# EAGLE design IoTSchem (EAGLE 9.6.2)
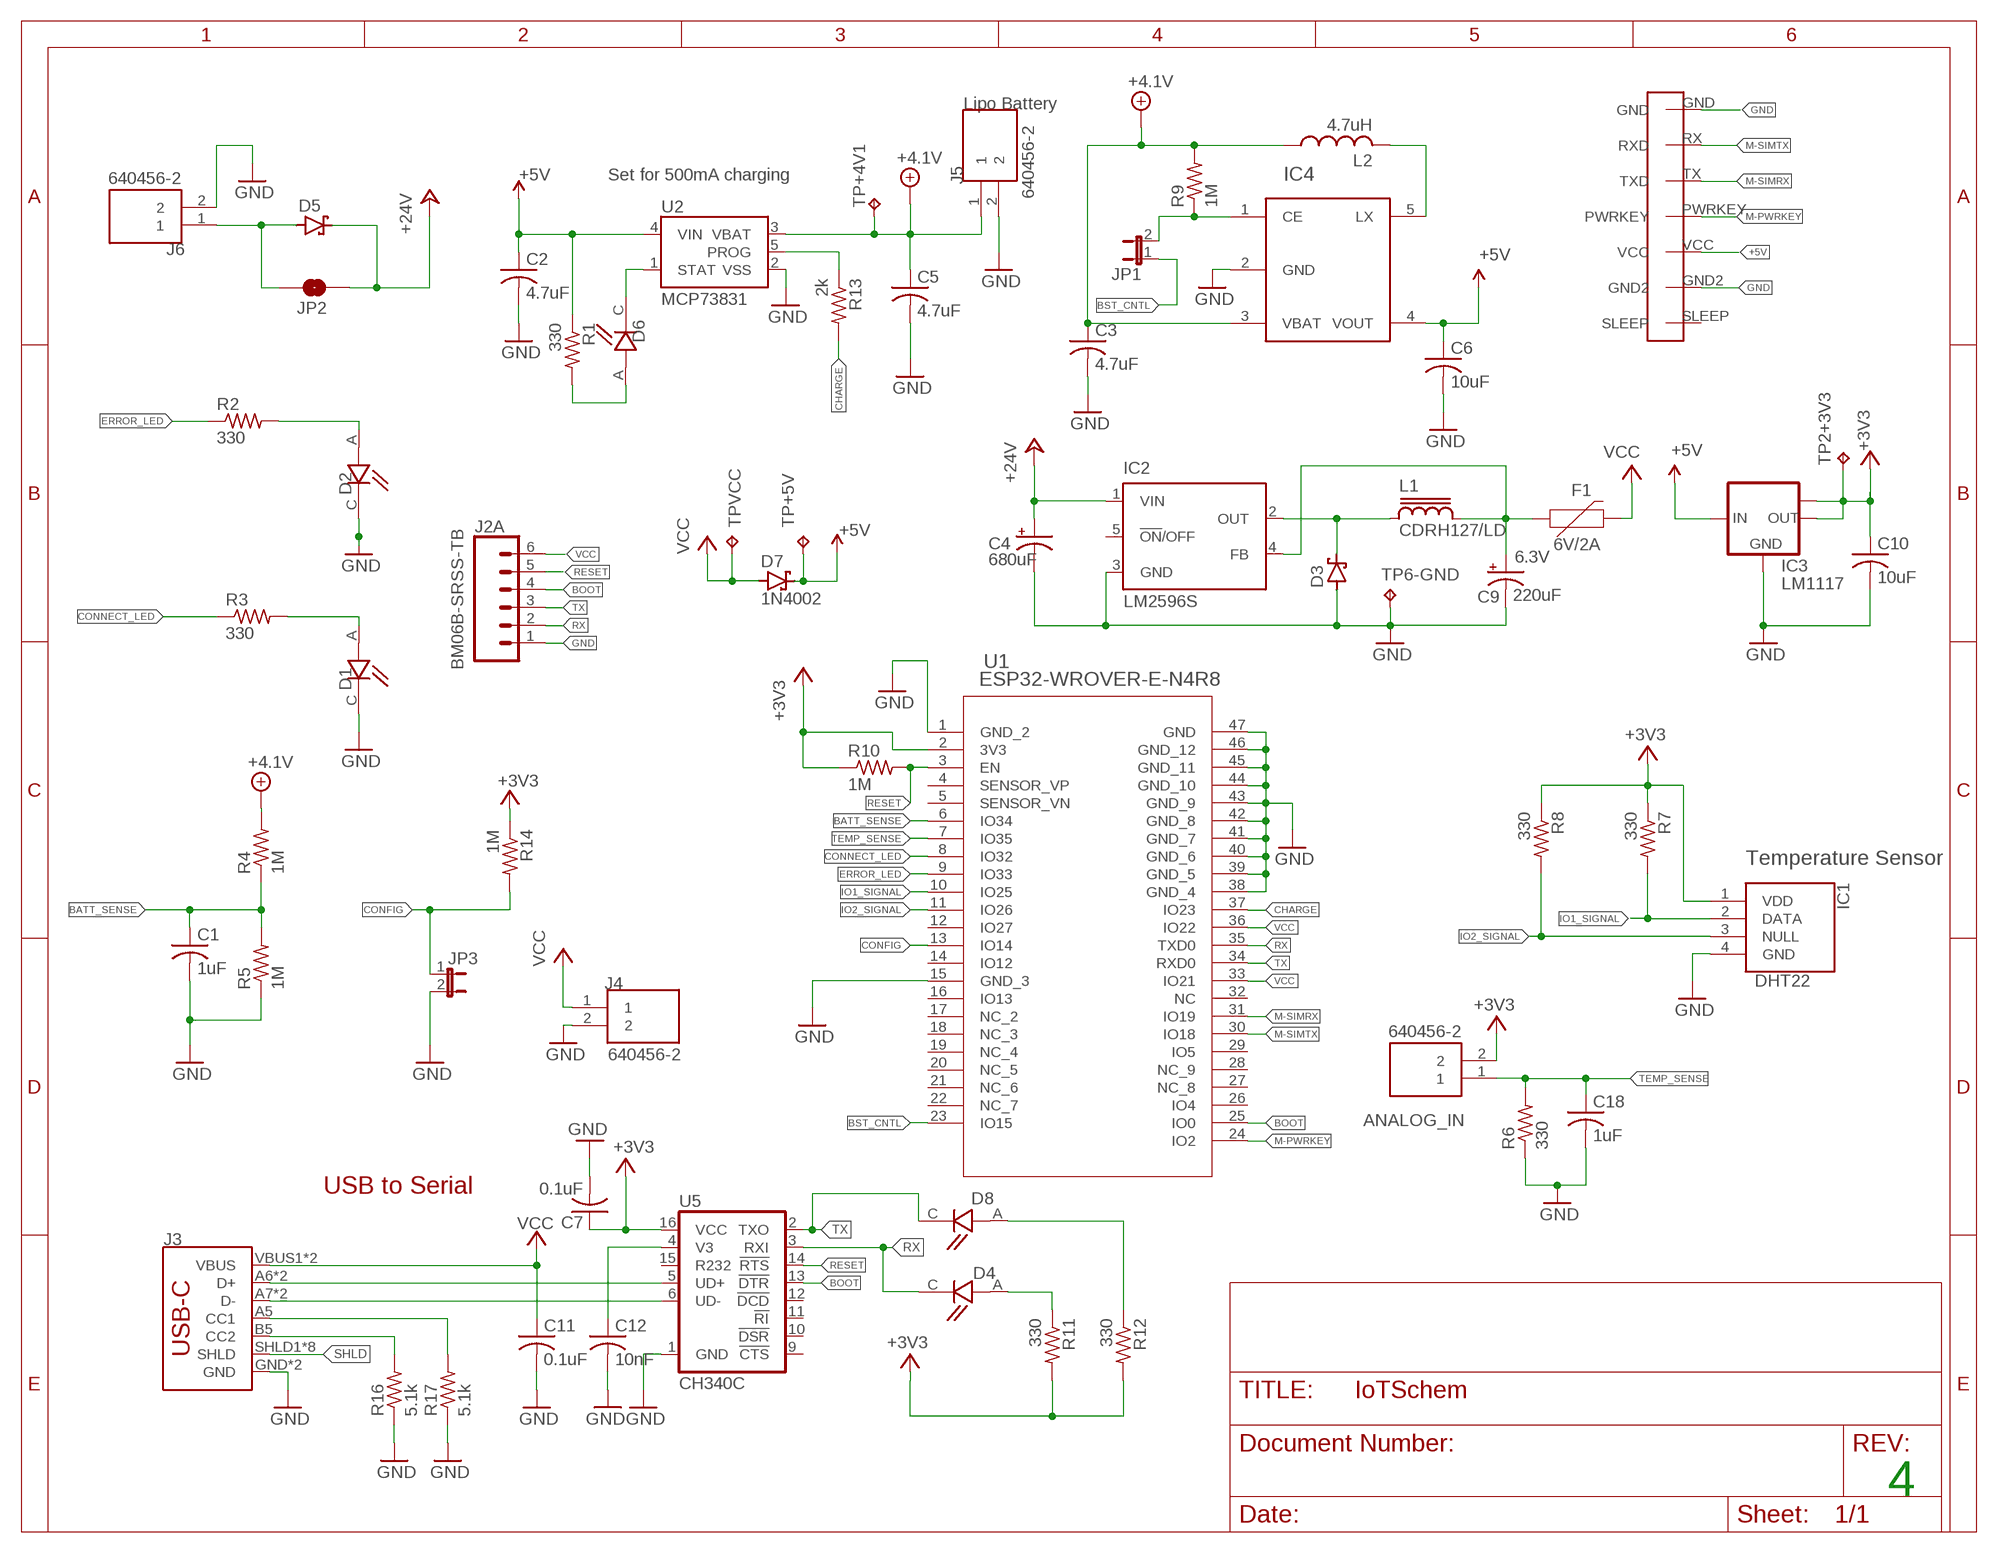
[diagram p0: schematic, sheet 1]

## Parts
ANALOG_IN  640456-2  [TE_640456-2]
C1  1uF  C-USC0805  [C0805]
C2  4.7uF  C-USC0805  [C0805]
C3  4.7uF  C-USC0805  [C0805]
C4  680uF  CPOL-USE5-10.5  [E5-10,5]
C5  4.7uF  C-USC0805  [C0805]
C6  10uF  C-USC0805  [C0805]
C7  0.1uF  C-USC0805  [C0805]
C9  220uF  CPOL-USUD-6,3X5,8  [UD-6,3X5,8_NICHICON]
C10  10uF  C-USC0805  [C0805]
C11  0.1uF  C-USC0805  [C0805]
C12  10nF  C-USC0805  [C0805]
C18  1uF  C-USC0805  [C0805]
D1  5988170107F  [LEDC2012X70N]
D2  5988170107F  [LEDC2012X70N]
D3  SCHOTTKY-DIODESMD  [SMB]
D4  5988170107F  [LEDC2012X70N]
D5  1N4002  SCHOTTKY-DIODESMD  [SMB]
D6  5988170107F  [LEDC2012X70N]
D7  1N4002  SCHOTTKY-DIODESMD  [SMB]
D8  5988170107F  [LEDC2012X70N]
F1  6V/2A  PPTC_6V2A  [1210]
IC1  DHT22  [DHT22]
IC2  LM2596S  [TO263-5]
IC3  LM1117MPX-3.3  [SOT223]
IC4  XC9140  [SOT-25]
J1  SIM7000A  [SIM7000A]
J2  BM06B-SRSS-TB  JST_6_PIN_HORIZONTAL  [JST-6-SMD-HORI-1.0MM]
J3  USB_C16PIN  [USB-C-16P]
J4  640456-2  [TE_640456-2]
J5  640456-2  [TE_640456-2]
J6  640456-2  [TE_640456-2]
JP1  JP1E  [JP1]
JP2  JUMPER-SMT_2_NO_SILK  [SMT-JUMPER_2_NO_SILK]
JP3  JP1E  [JP1]
L1  CDRH127/LD  [CDRH127/LD]
L2  4.7uH  L-USL2825P  [L2825P]
R1  330  R-US_R0805  [R0805]
R2  330  R-US_R0805  [R0805]
R3  330  R-US_R0805  [R0805]
R4  1M  R-US_R0805  [R0805]
R5  1M  R-US_R0805  [R0805]
R6  330  R-US_R0805  [R0805]
R7  330  R-US_R0805  [R0805]
R8  330  R-US_R0805  [R0805]
R9  1M  R-US_R0805  [R0805]
R10  1M  R-US_R0805  [R0805]
R11  330  R-US_R0805  [R0805]
R12  330  R-US_R0805  [R0805]
R13  2k  R-US_R0805  [R0805]
R14  1M  R-US_R0805  [R0805]
R16  5.1k  R-US_R0805  [R0805]
R17  5.1k  R-US_R0805  [R0805]
TP2+3V3  TPB1,27  [B1,27]
TP6-GND  TPB1,27  [B1,27]
TP+4V1  TPB1,27  [B1,27]
TP+5V  TPB1,27  [B1,27]
TPVCC  TPB1,27  [B1,27]
U1  ESP32-WROVER-E-N4R8  [ESP32­WROVER­E/ESP32­WROVER­IE]
U2  MCP73831  [SOT23-5]
U5  CH340C  [SO016]

## Nets
+3V3 [power]: ANALOG_IN.2 C7.1 C10.1 IC1.1(VDD) IC3.2(OUT) IC3.TAB(OUT1) R7.1 R8.1 R10.1 R11.2 R12.2 R14.1 TP2+3V3.TP U1.2(3V3) U5.16(VCC)
+4.1V [power]: C3.1 C5.1 IC4.3(VBAT) J5.1 L2.1 R4.2 R9.2 TP+4V1.TP U2.3(VBAT)
+5V [power]: C2.1 C6.1 D7.C IC3.3(IN) IC4.4(VOUT) J1.VCC R1.1 TP+5V.TP U2.4(VIN) ; supply symbol labelled 5V
+24V: C4.+ D5.C IC2.1(VIN) JP2.2
BATT_SENSE: C1.1 R4.1 R5.2 U1.6(IO34)
BOOT: J2.4 U1.25(IO0) U5.13(!DTR)
BST_CNTL: JP1.1 U1.23(IO15)
CC1: J3.A5(CC1) R17.2
CC2: J3.B5(CC2) R16.2
CHARGE: R13.1 U1.37(IO23) U2.5(PROG)
CONFIG: JP3.1 R14.2 U1.13(IO14)
CONNECT_LED: R3.1 U1.8(IO32)
D+: J3.A6(D+) J3.B6(D+) U5.5(UD+)
D-: J3.A7(D-) J3.B7(D-) U5.6(UD-)
ERROR_LED: R2.1 U1.9(IO33)
GND: C1.2 C2.2 C3.2 C4.- C5.2 C6.2 C7.2 C9.- C10.2 C11.2 C12.2 C18.2 D1.C D2.C D3.A IC1.4(GND) IC2.3(GND) IC3.1(GND) IC4.2(GND) J1.GND J1.GND2 J2.1 J3.GND J3.GND2(GND) J4.2 J5.2 J6.2 JP3.2 R5.1 R6.1 R16.1 R17.1 TP6-GND.TP U1.1(GND_2) U1.15(GND_3) U1.38(GND_4) U1.39(GND_5) U1.40(GND_6) U1.41(GND_7) U1.42(GND_8) U1.43(GND_9) U1.44(GND_10) U1.45(GND_11) U1.46(GND_12) U1.47(GND) U2.2(VSS) U5.1(GND)
IO1_SIGNAL: IC1.2(DATA) R7.2 U1.10(IO25)
IO2_SIGNAL: IC1.3(NULL) R8.2 U1.11(IO26)
M-PWRKEY: J1.PWRKEY U1.24(IO2)
M-SIMRX: J1.TX(TXD) U1.31(IO19)
M-SIMTX: J1.RX(RXD) U1.30(IO18)
N$1: D5.A J6.1 JP2.1
N$2: C12.1 U5.4(V3)
N$3: D6.A R1.2
N$4: IC4.5(LX) L2.2
N$5: D1.A R3.2
N$6: D2.A R2.2
N$7: R13.2
N$8: IC4.1(CE) JP1.2 R9.1
N$9: C9.+ F1.1 IC2.4(FB) L1.2
N$10: D8.A R12.1
N$11: D4.A R11.1
OUT [ADC]: D3.C IC2.2(OUT) L1.1
RESET: J2.5 R10.2 U1.3(EN) U5.14(!RTS)
RX: D4.C J2.2 U1.35(TXD0) U5.3(RXI)
SHLD: J3.SHLD1(SHLD) J3.SHLD2(SHLD) J3.SHLD3(SHLD) J3.SHLD4(SHLD) J3.SHLD5(SHLD) J3.SHLD6(SHLD) J3.SHLD7(SHLD) J3.SHLD8(SHLD)
STAT: D6.C U2.1(STAT)
TEMP_SENSE [LOGIC]: ANALOG_IN.1 C18.1 R6.2 U1.7(IO35)
TX: D8.C J2.3 U1.34(RXD0) U5.2(TXO)
VCC: C11.1 D7.A F1.2 J2.6 J3.VBUS1(VBUS) J3.VBUS2(VBUS) J4.1 TPVCC.TP U1.33(IO21) U1.36(IO22)
Unconnected: IC2.5(!ON!/OFF) J1.SLEEP J2.M1 J2.M2 U1.4(SENSOR_VP) U1.5(SENSOR_VN) U1.12(IO27) U1.14(IO12) U1.16(IO13) U1.17(NC_2) U1.18(NC_3) U1.19(NC_4) U1.20(NC_5) U1.21(NC_6) U1.22(NC_7) U1.26(IO4) U1.27(NC_8) U1.28(NC_9) U1.29(IO5) U1.32(NC) U5.9(!CTS) U5.10(!DSR) U5.11(!RI) U5.12(!DCD) U5.15(R232)

## Notes on the sheet
- Lipo Battery
- Set for 500mA charging
- Temperature Sensor
- USB to Serial
- 4

## Library data of the parts
ANALOG_IN J4-J6 = 640456-2:640456-2: 220P MTA100 HDR ASSY SQ SPCL; COMMENT: 640456-2; DESCRIPTION: Connector Header Through Hole 2 position 0.100 (2.54mm); DIGI-KEY_PART_NUMBER: A1921-ND; EU_ROHS_COMPLIANCE: Compliant; MF: TE Connectivity; MP: 640456-2; PACKAGE: None; PURCHASE-URL: https://pricing.snapeda.com/search/part/640456-2/?ref=eda
C1 C18 = rcl:C-US: CAPACITOR, American symbol; DIGIKEYPART#: 311-1365-1-ND; SPICEPREFIX: C
C2 C3 C5 = rcl:C-US: CAPACITOR, American symbol; DIGIKEYPART#: 1276-6722-1-ND; SPICEPREFIX: C
C4 = rcl:CPOL-US: POLARIZED CAPACITOR, American symbol; VOLTAGE: 25V
C6 = rcl:C-US: CAPACITOR, American symbol; SPICEPREFIX: C
C7 C11 = rcl:C-US: CAPACITOR, American symbol; DIGIKEYPART#: 311-1140-1-ND; SPICEPREFIX: C
C9 = rcl:CPOL-US: POLARIZED CAPACITOR, American symbol; VOLTAGE: 6.3V
C10 = rcl:C-US: CAPACITOR, American symbol; DIGIKEYPART#: 399-C0805C106K8PAC7800CT-ND; SPICEPREFIX: C
C12 = rcl:C-US: CAPACITOR, American symbol; DIGIKEYPART#: 1276-1015-1-ND; SPICEPREFIX: C
D1 D2 D4 D6 D8 = 5988170107F:5988170107F: Standard LEDs - SMD Green Water Clr 40mcd 570nm; DESCRIPTION: Green 566nm LED Indication - Discrete 2V 0805 (2012 Metric); DIGI-KEY_PART_NUMBER: 350-2044-1-ND; MF: Dialight; MP: 5988170107F; PACKAGE: 0805 Dialight; PURCHASE-URL: https://pricing.snapeda.com/search/part/5988170107F/?ref=eda
D3 D5 D7 = diode:SCHOTTKY-DIODE: Schottky Diode
F1 = SparkFun-Fuses:PPTC: Resettable Fuse PPTC Resettable Fuse. Really a sort of resistor with a polymeric positive temperature coefficient whose resistance increases dramatically with an increase in temperature. When heated by the power passing through the resistance rises causing the current to be limited, protecting the circuit. This is achieved by the transition of the polymer from a crystalline to an amorphous state where the conductive carbon separates breaking the conductive pathways found in the cool crystalline structure. When a PPTC cools back down it resumes conducting letting the circuit turn back on. SparkFun Products: SparkFun RedBoard - Programmed with Arduino <https://www.sparkfun.com/products/12757> Pro Micro - 5V/16MHz <https://www.sparkfun.com/products/12640> Arduino Pro 328 - 5V/16MHz <https://www.sparkfun.com/products/10915> MP3 Trigger <https://www.sparkfun.com/products/13720>; PROD_ID: RES-14313
IC1 = DHT22:DHT22: Digital-output relative humidity & temperature sensor/module DHT22 Source: Datasheet <https://datasheet4u.com/datasheet-parts/DHT22-datasheet.php?id=792211>; DESCRIPTION: Digital-output relative humidity & temperature sensor/module DHT22; DIGIKEYPART#: 1528-1504-ND; HEIGHT: 25.1mm; MANUFACTURER_NAME: Aosong Electronics; MANUFACTURER_PART_NUMBER: DHT22
IC2 = national-semiconductor:LM2596: SIMPLE SWITCHER® Power Converter 150 kHz 3A Step-Down Voltage Regulator Source: http://www.national.com/ds/LM/LM2596.pdf; DIGIKEYPART#: 2156-LM2596SX-5.0/NOPB-ND; MF: NATIONAL SEMICONDUCTOR; MPN: LM2596S-ADJ/NOPB; OC_FARNELL: 9494367; OC_NEWARK: 41K3842
IC3 = lm1117:LM1117MPX-*; DIGIKEYPART#: LM1117IMP-3.3/NOPBCT-ND
IC4 = MyLIb:XC9140; DIGIKEYPART#: 893-1181-1-ND
J1 = SoftwareLogisticsParts:SIM7000A
J2 = SparkFun-Connectors:JST_6_PIN_HORIZONTAL: JST 6 pin horizontal connector JST-SH type. Here is the connector we sell at SparkFun: name <link> (XXX-00000) Datasheet <http://www.sparkfun.com/datasheets/GPS/EM406-SMDConnector-eSH.pdf> It was used on these SparkFun products: name <link> (XXX-00000) name <link> (XXX-00000); PROD_ID: XXX-00000
J3 = SparkFun-Connectors:USB_C: USB Type C 16Pin Connector Super Speed pins not available on the 16-pin purely SMD connector so this part is best for USB 2.0 implementations. D1 and D2 are tied together enabling D+/- no matter which way the cable is plugged into the connector. The two channel configuration pins (CC1/2) are exposed. These are normally connected to ground via 5.1k resistors but can be reconfigured for high current/high power applications.; PROD_ID: CONN-14122
JP1 JP3 = jumper:JP1E: JUMPER
JP2 = SparkFun-Jumpers:JUMPER-SMT_2_NO: Normally open jumper This jumper has two pads in close proximity to each other. Apply solder to close the connection. Round pads are easier to solder for beginners, but are a lot larger. SparkFun Product that uses the round pads: SparkFun EL Sequencer <https://www.sparkfun.com/products/12781>
L1 = inductor-sumida:CDRH127/LD: Power Inductor
L2 = rcl:L-US: INDUCTOR, American symbol; SPICEPREFIX: L
R1 = rcl:R-US_: RESISTOR, American symbol; SPICEPREFIX: R
R2 R3 R6-R8 R11 R12 = rcl:R-US_: RESISTOR, American symbol; DIGIKEYPART#: RMCF0805JT330RCT-ND; SPICEPREFIX: R
R4 R5 R9 R10 R14 = rcl:R-US_: RESISTOR, American symbol; DIGIKEYPART#: RMCF0805JT1M00CT-ND; SPICEPREFIX: R
R13 = rcl:R-US_: RESISTOR, American symbol; DIGIKEYPART#: RMCF0805FT2K00CT-ND; SPICEPREFIX: R
R16 R17 = rcl:R-US_: RESISTOR, American symbol; DIGIKEYPART#: RMCF0805JT5K10CT-ND; SPICEPREFIX: R
TP2+3V3 TP6-GND TP+4V1 TP+5V TPVCC = testpad:TP: Test pad
U1 = ESP32WROVER:ESP32-WROVER-E-N4R8; COPYRIGHT: Copyright (C) 2022 Ultra Librarian. All rights reserved.; DIGI-KEY_PART_NUMBER_1: 1965-ESP32-WROVER-E-N4R8TR-ND; DIGI-KEY_PART_NUMBER_2: 1965-ESP32-WROVER-E-N4R8CT-ND; DIGI-KEY_PART_NUMBER_3: 1965-ESP32-WROVER-E-N4R8DKR-ND; MANUFACTURER_PART_NUMBER: ESP32-WROVER-E-N4R8; MFR_NAME: Espressif Systems
U2 = SparkFun-PowerIC:MCP73831: Miniature single cell, fully integrated Li-Ion, Li-polymer charge management controller http://ww1.microchip.com/downloads/en/DeviceDoc/21984a.pdf IC-09995; DIGIKEYPART#: MCP73831T-2DCI/OTCT-ND; PROD_ID: IC-09995
U5 = SparkFun-IC-Comms:CH340C; PROD_ID: IC-14038

## Net classes
0 default: width 0.203 mm, drill 0.406 mm, clearance 0.203 mm
1 power: width 0.305 mm, drill 0.508 mm, clearance 0.305 mm
3 LOGIC: width 0.203 mm, drill 0.406 mm, clearance 0.203 mm
4 ADC: width 0.203 mm, drill 0.406 mm, clearance 0.203 mm

## Board
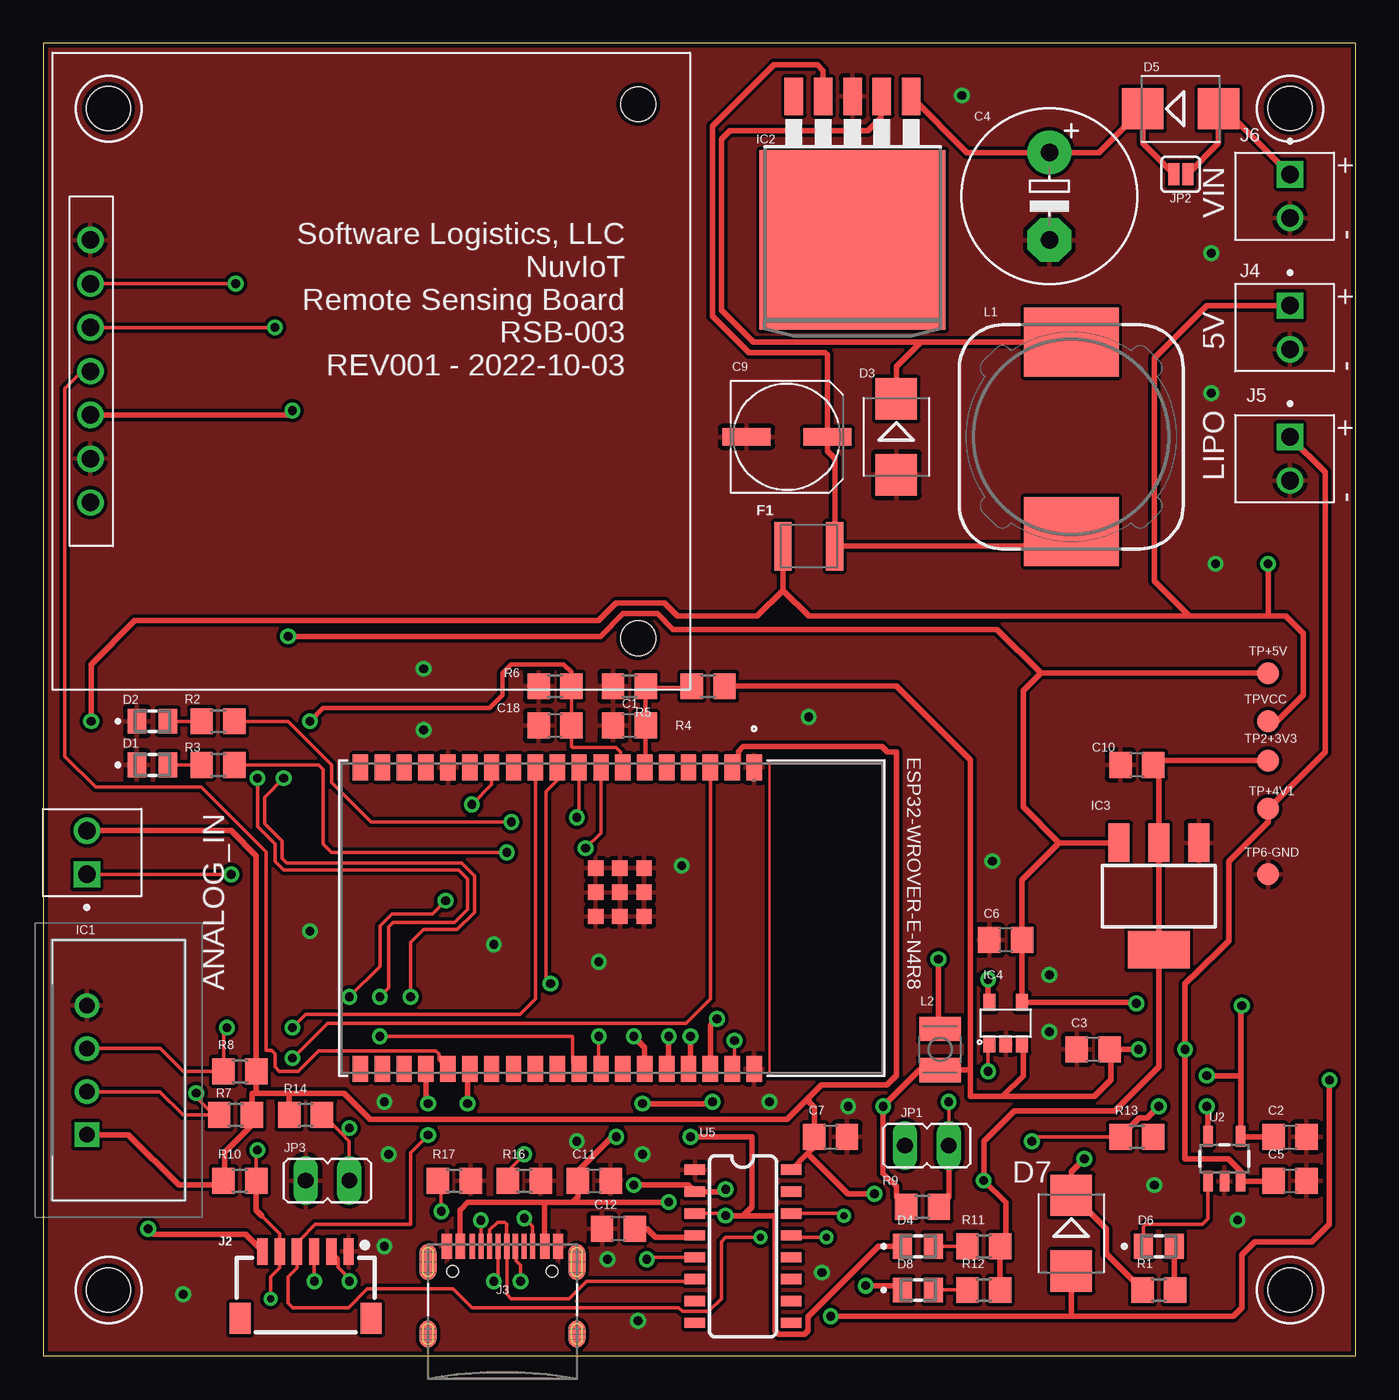
[diagram p1: board, top side]
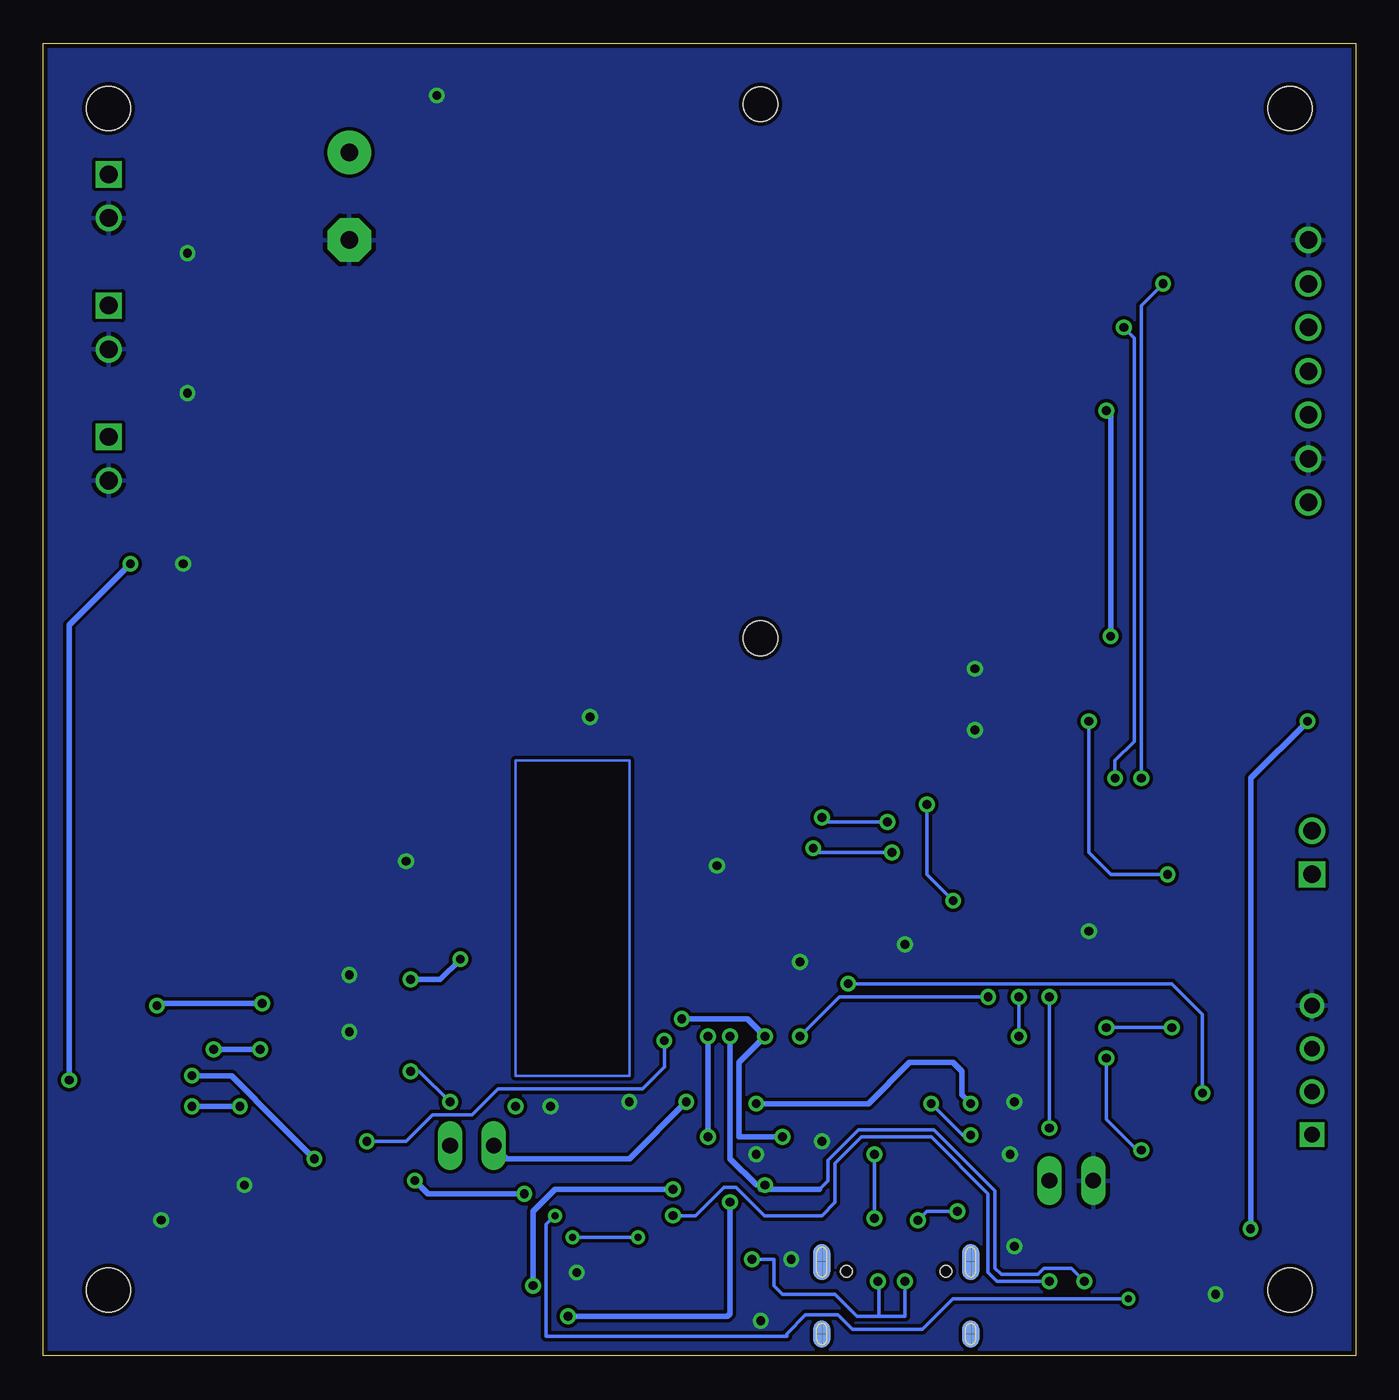
[diagram p2: board, bottom side, seen from below]

Size 76.2 x 76.2 mm. Coordinates in mm from the lower left corner, seen from the top.
Outline: 0,0 76.2,0 76.2,76.2 0,76.2 0,0
Copper layers (1*16): Top 0.035mm / dielectric 1.5mm / Bottom 0.035mm
Design rules "default *": minimum track width 6mil, minimum drill 0.35mm, track to track 2mil, track to pad 2mil, pad to pad 2mil, via to via 2mil, smd to smd 2mil, copper to edge 10mil, drill to drill 6mil, minimum pad ring 10mil, minimum via ring 8mil, stop-mask expansion 4mil, vias tented up to drill 0mil, thermal gap 10mil
Holes 2.54 mm at 3.81,3.81 72.39,3.81 3.81,72.39 72.39,72.39

### Footprints (pad centres in the part's own frame; a part is rotated, then mirrored left to right if it is on the bottom)
TE_640456-2 = drill 1.02 pad 1.37 square: 1 0,0 | drill 1.02 pad 1.37: 2 -2.54,0
C0805 = smd 1.3 x 1.5: 1 -0.95,0; 2 0.95,0
E5-10,5 = drill 1.016 pad 2.54: + -2.54,0 | drill 1.016 pad 2.54 octagon: - 2.54,0
UD-6,3X5,8_NICHICON = smd 2.8 x 1: + 2.35,0; - -2.35,0
LEDC2012X70N = smd 1.1 x 1.45: A 0.9,0; C -0.9,0
SMB = smd 2.4 x 2.4: A 2.2,0; C -2.2,0
1210 = smd 1 x 2.8: 1 -1.5,0; 2 1.5,0
DHT22 = drill 0.91 pad 1.416 square: 1 0,0 | drill 0.91 pad 1.416: 2 2.5,0; 3 5,0; 4 7.5,0
TO263-5 = smd 1.067 x 2.159: 1 -3.404,-5.791; 2 -1.702,-5.791; 3 0,-5.791; 4 1.702,-5.791; 5 3.404,-5.791 | smd 10.8 x 10.41: 6 0,2.54
SOT223 = smd 1.219 x 2.235: 1 -2.311,-3.099; 2 0,-3.099; 3 2.311,-3.099 | smd 3.6 x 2.2: TAB 0,3.099
SOT-25 = smd 0.7 x 1: 1 -0.95,-1.2; 2 0,-1.2; 3 0.95,-1.2; 4 0.95,1.2; 5 -0.95,1.2
SIM7000A = drill 1.016: GND -16.3,7.62; GND2 -16.3,-5.08; PWRKEY -16.3,0; RX -16.3,5.08; SLEEP -16.3,-7.62; TX -16.3,2.54; VCC -16.3,-2.54 | hole 2: 15.5,-15.5; 15.5,15.5
JST-6-SMD-HORI-1.0MM = smd 0.6 x 1.55: 1 -2.5,-4.775; 2 -1.5,-4.775; 3 -0.5,-4.775; 4 0.5,-4.775; 5 1.5,-4.775; 6 2.5,-4.775 | smd 1.2 x 1.8: M1 -3.8,-0.9; M2 3.8,-0.9
USB-C-16P = smd 0.3 x 1.45: A5 -1.25,0; A6 -0.25,0; A7 0.25,0; A8 1.25,0; B5 1.75,0; B6 0.75,0; B7 -0.75,0; B8 -1.75,0 | smd 0.6 x 1.45: GND -3.225,0; GND2 3.225,0 | smd 1 x 2.1: SHLD1 -4.32,-0.915; SHLD2 4.32,-0.915 | smd 1 x 2.1 bottom: SHLD3 -4.32,-0.915; SHLD4 4.32,-0.915 | smd 1 x 1.6: SHLD5 -4.32,-5.095; SHLD8 4.32,-5.095 | smd 1 x 1.6 bottom: SHLD6 -4.32,-5.095; SHLD7 4.32,-5.095 | smd 0.55 x 1.45: VBUS1 -2.45,0; VBUS2 2.45,0 | hole 0.65: -2.89,-1.445; 2.89,-1.445
JP1 = drill 0.914 long: 1 0,-1.27; 2 0,1.27
SMT-JUMPER_2_NO_SILK = smd 0.635 x 1.27: 1 -0.406,0; 2 0.406,0
CDRH127/LD = smd 4 x 5.5: 1 -5.5,0; 2 5.5,0
L2825P = smd 1.4 x 2.4: 1 -1.2,0; 2 1.2,0
R0805 = smd 1.3 x 1.5: 1 -0.95,0; 2 0.95,0
B1,27 = smd 1.27 x 1.27: TP 0,0
ESP32­WROVER­E/ESP32­WROVER­IE = smd 1.499 x 0.889: 1 -8.75,8.26; 2 -8.75,6.99; 3 -8.75,5.72; 4 -8.75,4.45; 5 -8.75,3.18; 6 -8.75,1.91; 7 -8.75,0.64; 8 -8.75,-0.63; 9 -8.75,-1.9; 10 -8.75,-3.17; 11 -8.75,-4.44; 12 -8.75,-5.71; 13 -8.75,-6.98; 14 -8.75,-8.25; 15 -8.75,-9.52; 16 -8.75,-10.79; 17 -8.75,-12.06; 18 -8.75,-13.33; 19 -8.75,-14.6; 20 8.75,-14.6; 21 8.75,-13.33; 22 8.75,-12.06; 23 8.75,-10.79; 24 8.75,-9.52; 25 8.75,-8.25; 26 8.75,-6.98; 27 8.75,-5.71; 28 8.75,-4.44; 29 8.75,-3.17; 30 8.75,-1.9; 31 8.75,-0.63; 32 8.75,0.64; 33 8.75,1.91; 34 8.75,3.18; 35 8.75,4.45; 36 8.75,5.72; 37 8.75,6.99; 38 8.75,8.26 | smd 0.889 x 0.889: 39 -2.903,1.862; 40 -1.504,1.862; 41 -0.104,1.862; 42 -2.903,0.462; 43 -1.504,0.462; 44 -0.104,0.462; 45 -2.903,-0.937; 46 -1.504,-0.937; 47 -0.104,-0.937
SOT23-5 = smd 0.55 x 1.2: 1 -0.95,-1.3; 2 0,-1.3; 3 0.95,-1.3; 4 0.95,1.3; 5 -0.95,1.3
SO016 = smd 0.6 x 1.2: 1 -4.445,-2.8; 2 -3.175,-2.8; 3 -1.905,-2.8; 4 -0.635,-2.8; 5 0.635,-2.8; 6 1.905,-2.8; 7 3.175,-2.8; 8 4.445,-2.8; 9 4.445,2.8; 10 3.175,2.8; 11 1.905,2.8; 12 0.635,2.8; 13 -0.635,2.8; 14 -1.905,2.8; 15 -3.175,2.8; 16 -4.445,2.8

### Placement (x,y rotation side)
ANALOG_IN  2.54,27.94 270 top
C1  34.04,36.58 180 top
C2  72.39,12.7 0 top
C3  60.96,17.78 180 top
C4  58.42,67.31 270 top
C5  72.39,10.16 0 top
C6  55.88,24.13 180 top
C7  45.72,12.7 0 top
C9  43.18,53.34 0 top
C10  63.5,34.29 180 top
C11  32,10.16 0 top
C12  33.4,7.37 180 top
C18  29.72,36.58 180 top
D1  6.35,34.29 0 top
D2  6.35,36.83 0 top
D3  49.53,53.34 270 top
D4  50.8,6.35 0 top
D5  66.04,72.39 0 top
D6  64.77,6.35 0 top
D7  59.69,7.11 270 top
D8  50.8,3.81 0 top
F1  44.45,46.99 180 top
IC1  2.54,12.83 90 top
IC2  46.99,67.31 180 top
IC3  64.77,26.67 180 top
IC4  55.88,19.3 0 top
J1  19.05,57.15 0 top
J2  15.24,1.27 180 top
J3  26.67,6.35 0 top
J4  72.39,60.96 90 top
J5  72.39,53.34 90 top
J6  72.39,68.58 90 top
JP1  51.31,12.19 270 top
JP2  66.04,68.58 180 top
JP3  16.51,10.16 90 top
L1  59.69,53.34 270 top
L2  52.07,17.78 90 top
R1  64.77,3.81 0 top
R2  10.16,36.83 180 top
R3  10.16,34.29 180 top
R4  38.61,38.86 0 top
R5  34.04,38.86 0 top
R6  29.72,38.86 0 top
R7  11.18,13.97 180 top
R8  11.43,16.51 180 top
R9  51.05,8.64 180 top
R10  11.43,10.16 0 top
R11  54.61,6.35 0 top
R12  54.61,3.81 0 top
R13  63.5,12.7 0 top
R14  15.24,13.97 0 top
R16  27.94,10.16 180 top
R17  23.88,10.16 180 top
TP2+3V3  71.12,34.54 0 top
TP6-GND  71.12,27.94 0 top
TP+4V1  71.12,31.75 0 top
TP+5V  71.12,39.62 0 top
TPVCC  71.12,36.83 0 top
U1  33.02,25.4 270 top
U2  68.58,11.43 0 top
U5  40.64,6.35 270 top

### Tracks (layer width: path | path; a pad name or v marks a point on that pad's centre or on a via)
+3V3  (via drill 0.51)
  Top 0.305: IC1.1 4.95,12.83 7.87,9.91 10.23,9.91 R10.1 10.54,10.22 10.54,11.81 12.13,13.4 R7.1 12.13,15.24 12.38,15.24 | 12.38,15.24 R8.1 12.38,29.02 10.92,30.48 ANALOG_IN.2 | 12.38,15.24 14.22,15.24 | 14.22,15.24 17.48,15.24 19,13.72 43.18,13.72 44.45,14.99 | U5.16 44.39,11.74 | 44.39,11.74 44.77,12.12 C7.1 44.77,14.41 44.45,14.73 44.45,14.99 | 44.39,11.74 46.74,9.4 v48.26,9.4 | R11.2 55.56,6.1 | 55.56,6.1 R12.2 | 55.56,6.1 55.63,6.1 55.88,6.35 55.88,8.89 v54.61,10.16 54.61,12.45 56.39,14.22 62.23,14.22 64.77,16.76 IC3.TAB IC3.2 64.77,33.97 C10.1 64.7,34.54 TP2+3V3.TP | U1.2 40.38,34.52 40.38,35.09 40.65,35.36 48.71,35.36 49.01,35.05 49.53,35.05 49.53,16.26 49.52,16.26 48.99,15.72 45.19,15.72 44.45,14.99 | R14.1 14.29,15.17 14.22,15.24
  Bottom 0.305: v54.61,10.16 53.85,9.4 v48.26,9.4
+4.1V  (via drill 0.51)
  Top 0.305: C5.1 71.41,10.13 U2.3 69.53,10.7 68.8,11.43 66.29,11.43 v66.29,17.78 66.29,21.59 66.72,22.01 66.76,22.01 68.83,24.09 68.83,28.7 71.12,30.99 TP+4V1.TP 74.42,35.05 74.42,51.31 J5.1 | v63.6,17.78 61.98,17.78 | 61.98,17.78 C3.1 | IC4.3 56.9,18.04 56.9,16.26 55.7,15.06 | 53.85,16.58 L2.1 50.87,16.58 v48.77,14.48 48.77,10.59 49.53,9.83 49.53,9.21 R9.2 | 55.7,15.06 53.85,15.06 53.85,16.58 | 55.7,15.06 61.03,15.06 61.98,16 61.98,17.78 | 53.85,16.58 53.85,23.16 53.82,23.19 53.82,34.57 49.53,38.86 R4.2
  Bottom 0.305: v66.29,17.78 v63.6,17.78
+5V  (via drill 0.51)
  Top 0.305: C2.1 69.56,12.7 U2.4 69.53,16.26 | v69.6,20.32 69.53,20.25 69.53,16.26 | IC3.3 58.98,29.77 | 58.98,29.77 56.83,27.62 C6.1 IC4.4 63.42,20.5 v63.48,20.45 | 58.98,29.77 56.9,31.85 56.9,38.61 57.91,39.62 | 57.91,39.62 TP+5V.TP | v60.45,11.43 59.69,10.67 D7.C 59.78,9.31 61.72,7.37 61.72,5.91 R1.1 | v67.56,16.26 69.53,16.26 | 57.91,39.62 55.37,42.16 36.58,42.16 35.66,43.08 33.68,43.08 32.36,41.76 v14.22,41.76 | v14.48,54.86 14.22,54.61 J1.VCC
  Bottom 0.305: v69.6,20.32 69.47,20.45 v63.48,20.45 | v60.45,11.43 63.86,14.83 63.86,14.86 65.25,16.26 v67.56,16.26 | v14.22,41.76 14.22,54.61 v14.48,54.86
+24V
  Top 0.305: IC2.1 53.65,69.85 C4.+ 61.3,69.85 D5.C 63.84,70.37 JP2.2
BATT_SENSE
  Top 0.203: 34.89,38.77 R5.2
  Top 0.254: R4.1 37.56,38.77 34.89,38.77 | U1.6 34.99,34.21 C1.1 R5.2
BOOT  (via drill 0.41, 0.51)
  Top 0.203: v22.35,12.8 21.34,11.79 21.34,7.62 15.81,7.62 14.88,6.69 14.88,6.19 J2.4 14.74,5.09 14.22,4.57 14.22,3.05 14.48,2.79 17.73,2.79 18.82,3.88 23.8,3.88 24.89,2.79 36.89,2.79 37.11,2.57 38.64,2.57 39.37,3.3 39.37,6.6 39.62,6.86 v41.66,6.86 | 24.64,16.51 U1.25 | v45.47,6.86 43.57,6.86 U5.13
  Top 0.305: v24.64,14.63 24.64,16.51
  Bottom 0.203: v24.64,14.63 22.81,12.8 v22.35,12.8 | v41.66,6.86 v45.47,6.86
BST_CNTL  (via drill 0.51)
  Top 0.305: U1.23 22.23,14.75 v22.35,14.63 | v38.86,14.73 38.76,14.63 v34.8,14.63
  Bottom 0.305: v22.35,14.63 22.86,15.14 22.86,16.51 23.37,17.02 25.91,17.02 28.3,14.63 v34.8,14.63 | JP1.1 49.28,11.43 42.16,11.43 v38.86,14.73
CC1  (via drill 0.51)
  Top 0.203: J3.A5 v25.42,7.85 v25.41,7.86 | v23.11,8.38 23.11,9.97 R17.2
  Bottom 0.203: v25.41,7.86 24.89,8.38 v23.11,8.38
CC2  (via drill 0.51)
  Top 0.203: J3.B5 28.42,7.5 v27.94,7.98 | v27.94,11.68 26.99,10.73 R16.2
  Bottom 0.203: v27.94,7.98 v27.94,11.68
CHARGE  (via drill 0.51)
  Top 0.203: R13.1 57.66,12.7 v57.4,12.45 | v40.13,18.29 40.13,16.77 U1.37
  Top 0.305: U2.5 67.63,14.41 v67.56,14.48 | v64.77,14.48 64.1,13.81 63.65,13.81 63.44,13.6 63.44,13.59 R13.1
  Bottom 0.203: v57.4,12.45 55.12,12.45 53.59,13.97 51.31,13.97 49.78,15.49 41.4,15.49 40.13,16.76 v40.13,18.29
  Bottom 0.305: v67.56,14.48 v64.77,14.48
CONFIG  (via drill 0.51)
  Top 0.203: JP3.1 17.78,12.45 17.27,12.95 | 17.27,12.95 16.26,13.97 R14.2 | v23.37,26.42 22.61,25.65 20.25,25.65 19.56,24.96 19.56,22.61 v17.78,20.83 | v17.78,13.21 17.53,12.95 17.27,12.95 | v24.89,32 26.04,33.15 U1.13
  Bottom 0.203: v24.89,32 24.89,27.94 v23.37,26.42 | v17.78,20.83 v17.78,13.21
CONNECT_LED  (via drill 0.51)
  Top 0.203: v26.92,29.21 16.76,29.21 16.26,29.72 16.26,34.04 16,34.29 R3.1 | v31.5,29.46 32.39,30.36 U1.8
  Bottom 0.203: v31.5,29.46 31.24,29.21 v26.92,29.21
D+  (via drill 0.51)
  Top 0.203: J3.A6 26.42,4.58 v26.16,4.32 | J3.B6 27.46,6.3 27.46,5.5 27.73,5.24 v27.73,4.32 | v35.05,5.59 35.18,5.71 U5.5
  Bottom 0.203: v26.16,4.32 26.16,2.29 27.69,2.29 | v27.73,4.32 27.69,4.28 27.69,2.29 | 27.69,2.29 28.96,2.29 30.23,3.56 33.27,3.56 33.78,4.06 33.78,5.59 v35.05,5.59
D-
  Top 0.203: U5.6 37.71,4.32 31.56,4.32 30.55,3.3 27.18,3.3 26.92,3.56 J3.A7 26.92,7.62 26.8,7.75 26.37,7.75 25.92,7.29 J3.B7
ERROR_LED  (via drill 0.51)
  Top 0.203: R2.1 14.22,36.83 16.76,34.29 16.76,33.27 19.05,30.99 v27.18,30.99 | v30.99,31.24 31.12,31.37 U1.9
  Bottom 0.203: v30.99,31.24 30.73,30.99 v27.18,30.99
GND  (via drill 0.51)
  other vias: 22.1,36.32 37.08,28.45 64.52,9.91 58.42,18.8 55.12,28.7 42.16,14.73 32.26,22.86 69.34,7.87 44.45,37.08 46.74,14.48 34.8,11.68 45.21,4.83 26.16,23.88 15.49,24.64 19.81,14.73 30.99,12.45 19.81,6.35 32.77,5.59 34.54,2.03 8.13,3.56 58.42,22.1 22.1,39.88 67.82,64.01 67.82,55.88 68.07,45.97 53.34,73.15 20.07,11.68
  pour Top: -1.27,-1.27 77.47,-1.27 77.47,77.47 -1.27,77.47
  pour Bottom: -2.54,-2.54 78.74,-2.54 78.74,78.74 -2.54,78.74
IO1_SIGNAL  (via drill 0.51)
  Top 0.203: IC1.2 6.77,15.33 8.13,13.97 R7.2 9.91,13.97 8.89,14.99 v8.89,15.24 | v29.46,21.59 29.21,21.84 29.21,32.75 29.85,33.39 U1.10
  Bottom 0.203: v8.89,15.24 8.89,19.81 10.67,21.59 v29.46,21.59
IO2_SIGNAL  (via drill 0.51)
  Top 0.203: IC1.3 6.81,17.83 8.13,16.51 R8.2 10.48,18.86 v10.67,19.05 | v14.48,19.05 15.24,19.81 27.69,19.81 28.58,20.71 U1.11
  Bottom 0.203: v10.67,19.05 v14.48,19.05
KEEPOUT
  Top 0.152: 42.16,16.26 48.77,16.26 48.77,34.54 42.16,34.54 42.16,16.26
  Bottom 0.152: 42.16,16.26 48.77,16.26 48.77,34.54 42.16,34.54 42.16,16.26
M-PWRKEY
  Top 0.203: U1.24 22.98,17.17 22.98,17.52 22.8,17.7 15.99,17.7 14.79,16.51 13.72,16.51 13.46,16.76 13.46,17.53 13.27,17.72 12.95,17.72 12.95,29.24 9.17,33.02 3.05,33.02 1.27,34.8 1.27,56.13 2.29,57.15 J1.PWRKEY
M-SIMRX  (via drill 0.51)
  Top 0.203: U1.31 32.26,16.78 v32.26,18.54 | v21.34,20.83 21.34,23.98 22.1,24.74 24.04,24.74 25.04,25.74 25.04,27.85 24.3,28.6 14.14,28.6 13.87,28.87 13.87,29.89 12.86,30.89 12.86,32.42 v13.97,33.53 | v13.46,59.69 J1.TX
  Bottom 0.203: v32.26,18.54 29.97,20.83 v21.34,20.83 | v13.97,33.53 13.97,34.54 12.85,35.66 12.85,59.08 v13.46,59.69
M-SIMTX  (via drill 0.51)
  Top 0.203: U1.30 30.73,17.04 30.73,18.54 v19.56,18.54 | v19.56,20.83 20.07,21.34 20.07,24.89 20.32,25.15 23.88,25.15 24.64,25.91 24.64,27.69 24.13,28.19 13.97,28.19 13.46,28.7 13.46,29.72 12.45,30.73 v12.45,33.53 | v11.18,62.23 J1.RX
  Bottom 0.203: v19.56,18.54 v19.56,20.83 | v11.18,62.23 12.45,60.96 v12.45,33.53
N$1
  Top 0.305: J6.1 68.58,72.39 D5.A 68.24,70.37 JP2.1
N$2
  Top 0.305: C12.1 35.05,7.37 35.56,6.86 37.71,6.86 U5.4
N$3
  Top 0.305: D6.A 65.67,3.86 R1.2
N$4  (via drill 0.51)
  Top 0.305: IC4.5 54.86,20.57 v54.86,21.84 | v51.97,23.02 51.97,19.08 L2.2
  Bottom 0.305: v54.86,21.84 53.15,21.84 v51.97,23.02
N$5
  Top 0.203: R3.2 D1.A
N$6
  Top 0.203: R2.2 D2.A
N$8  (via drill 0.51)
  Top 0.203: JP1.2 v52.58,14.73 | v54.86,16.51 54.86,18.04 IC4.1
  Top 0.305: JP1.2 52.58,9.21 R9.1
  Bottom 0.203: v52.58,14.73 54.36,16.51 v54.86,16.51
N$9
  Top 0.305: L1.2 58.84,46.99 F1.1 45.97,47.01 45.97,52.07 45.53,52.51 C9.+ 45.53,58.1 45.4,58.23 40.98,58.23 38.86,60.35 38.86,71.37 42.42,74.93 44.96,74.93 45.29,74.6 IC2.4
N$10
  Top 0.203: D8.A R12.1
N$11
  Top 0.203: D4.A R11.1
OUT
  Top 0.305: L1.1 50.97,58.84 | 50.97,58.84 49.53,57.4 D3.C | 50.97,58.84 41.24,58.84 39.37,60.71 39.37,70.61 39.88,71.12 47.89,71.12 48.64,71.87 48.64,73.05 IC2.2
RESET  (via drill 0.41, 0.51)
  Top 0.203: 12.7,8.13 13.74,7.09 J2.5 13.74,5.1 13.21,4.57 v13.21,3.3 | U5.14 46.35,8.26 v46.48,8.13 | R10.2 12.38,11.87 v12.45,11.94 | v14.48,17.27 16.51,19.3 37.34,19.3 38.74,20.71 U1.3
  Top 0.305: 12.7,8.13 12.38,8.45 R10.2
  Bottom 0.203: v46.48,8.13 46.99,7.62 46.99,1.12 33.02,1.12 33.02,1.27 31.93,2.36 30.05,2.36 29.21,1.52 25.15,1.52 23.37,3.3 v13.21,3.3 | v12.45,11.94 12.7,11.94 14.48,13.72 v14.48,17.27
RX  (via drill 0.51)
  Top 0.203: J2.2 17.14,5.65 17.14,5.14 17.78,4.5 v17.78,4.32 | U5.3 39.5,8.26 v39.62,8.13
  Top 0.305: v37.59,18.54 37.59,16.77 U1.35 | D4.C 48.49,6.35 44.4,2.25 44.4,1.46 44.19,1.25 42.69,1.25 42.48,1.46 42.48,8.13 v39.62,8.13 40.64,8.13 41.15,8.64 41.15,12.7 v37.59,12.7
  Bottom 0.203: v17.78,4.32 20.83,4.32 21.34,4.83 21.34,9.4 24.64,12.7 28.7,12.7 30.23,11.18 30.23,8.89 30.99,8.13 34.31,8.13 35.96,9.78 36.68,9.78 38.33,8.13 v39.62,8.13
  Bottom 0.305: v37.59,12.7 v37.59,18.54
STAT
  Top 0.203: D6.C 63.87,7.48 64.01,7.62 67.31,7.62 67.63,7.94 U2.1
TEMP_SENSE  (via drill 0.51)
  Top 0.203: ANALOG_IN.1 v10.92,27.94 | U1.7 33.53,34.28 33.53,35.05 33.27,35.31 30.73,35.31 30.67,35.37 C18.1 R6.2
  Top 0.254: v15.49,36.83 16.26,37.59 25.91,37.59 26.67,38.35 26.67,39.62 27.18,40.13 30.23,40.13 30.67,39.69 R6.2
  Bottom 0.203: v10.92,27.94 14.22,27.94 15.49,29.21 v15.49,36.83
TX  (via drill 0.51)
  Top 0.203: J2.3 v15.75,4.32
  Top 0.305: D8.C 49.65,4.06 v47.75,4.06 | v34.29,9.91 37.46,9.91 U5.2 39.5,9.53 v39.62,9.65 | v36.32,18.54 36.32,16.77 U1.34
  Bottom 0.203: v15.75,4.32 16.51,5.08 18.1,5.08 18.45,4.72 20.57,4.72 20.93,5.08 20.93,9.57 24.47,13.11 28.87,13.11 30.63,11.34 30.63,10.16 31.14,9.65
  Bottom 0.305: v47.75,4.06 47.75,8.38 46.48,9.65 v39.62,9.65 | 31.14,9.65 34.54,9.65 v34.29,9.91 34.8,9.91 36.32,11.43 v36.32,18.54
VCC  (via drill 0.51)
  Top 0.305: J2.6 11.75,7.04 6.43,7.04 v6.1,7.37 | J4.1 67.56,60.96 64.52,57.91 64.52,44.96 66.55,42.93 | 59.69,2.29 69.09,2.29 69.6,2.79 69.6,5.84 70.36,6.6 73.66,6.6 74.68,7.62 v74.68,16 | 30.73,8.89 31.05,9.21 C11.1 31.05,10.73 33.02,12.7 v33.27,12.7 | 59.69,2.29 v45.72,2.29 | 30.73,8.89 36.3,8.89 v36.32,8.91 | 30.73,8.89 29.21,8.89 | 29.21,8.89 24.64,8.89 24.26,8.51 24.22,8.47 J3.VBUS1 | F1.2 42.95,44.43 | 42.95,44.43 44.45,42.93 66.55,42.93 | TPVCC.TP 71.63,36.83 73.15,38.35 73.15,41.91 72.14,42.93 71.12,42.93 | 66.55,42.93 71.12,42.93 | v71.12,45.97 71.12,42.93 | D7.A 59.69,2.29 | 42.95,44.43 41.45,42.93 36.83,42.93 36.07,43.69 33.27,43.69 32.26,42.67 5.33,42.67 2.79,40.13 v2.79,36.83 | U1.33 34.93,17.9 v34.29,18.54 | U1.36 38.74,19.18 v39.12,19.56 | J3.VBUS2 29.12,8.8 29.21,8.89
  Bottom 0.305: v45.72,2.29 36.48,2.29 36.32,2.44 v36.32,8.91 | v74.68,16 74.68,42.42 v71.12,45.97 | v2.79,36.83 6.1,33.53 v6.1,7.37 | v33.27,12.7 35.81,12.7 35.81,17.02 v34.29,18.54 35.31,19.56 v39.12,19.56

### Text on the board
tSilk: + | Software Logistics, LLC / NuvIoT / Remote Sensing Board / RSB-003 / REV001 - 2022-10-03 | VIN | - | + | 5V | - | + | LIPO | -